# EAGLE design V-00634-00 (EAGLE 7.2.0)
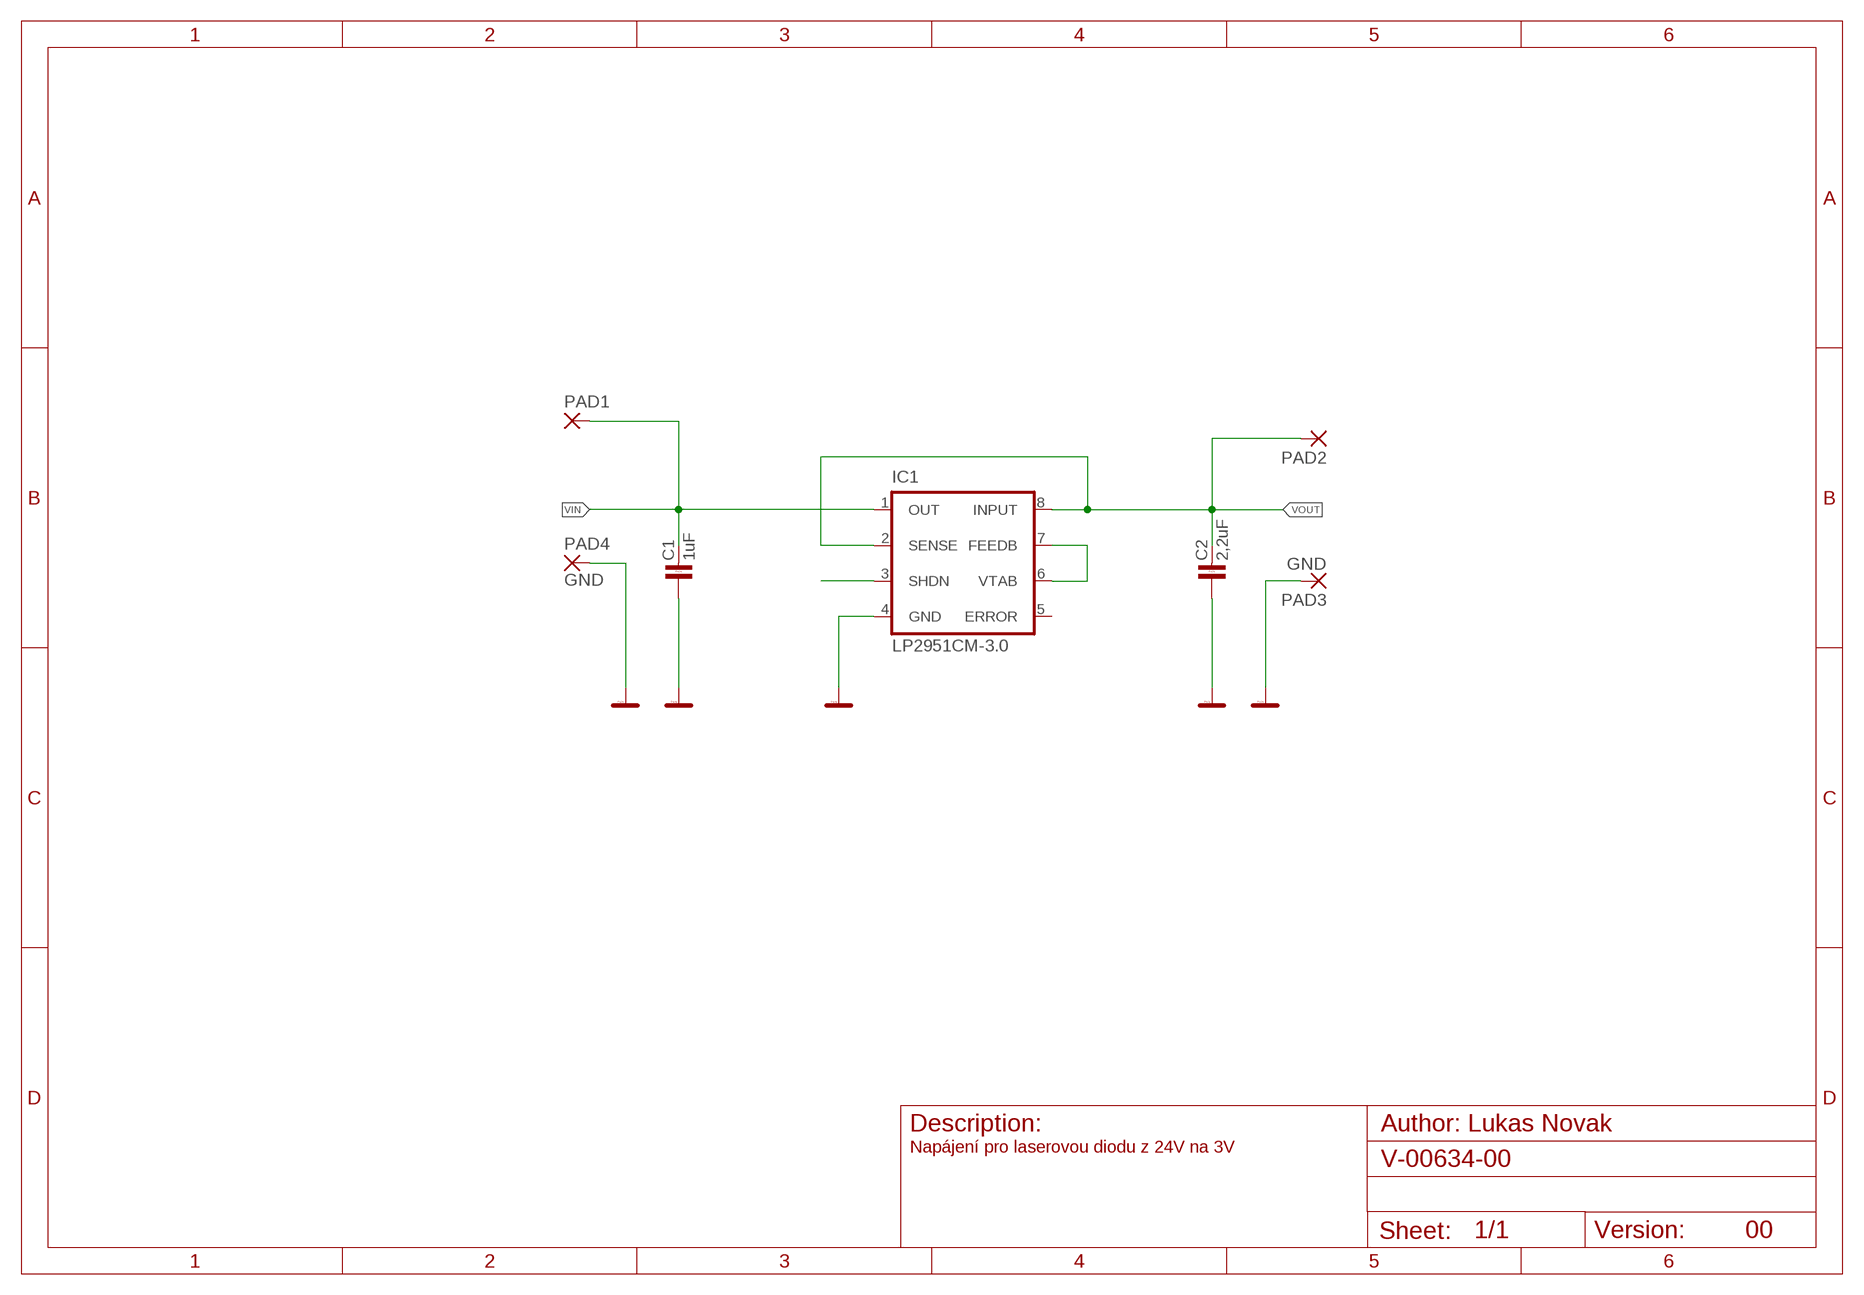
[diagram p0: schematic, sheet 1]

## Parts
C1  1uF  C-KER_1206  [1206]
C2  2,2uF  C-KER_1206  [1206]
IC1  LP2951CM-3.0  [SO-08]
PAD1  2,54/0,9  [2,54/0,9]
PAD2  2,54/0,9  [2,54/0,9]
PAD3  GND  2,54/0,9  [2,54/0,9]
PAD4  GND  2,54/0,9  [2,54/0,9]

## Nets
GND: C1.1 C2.1 IC1.4(GND) PAD3.1(P) PAD4.1(P)
N$1: IC1.6(VTAB) IC1.7(FEEDB)
N$2: IC1.3(SHDN)
VIN: C1.2 IC1.1(OUT) PAD1.1(P)
VOUT: C2.2 IC1.2(SENSE) IC1.8(INPUT) PAD2.1(P)
Unconnected: IC1.5(ERROR)

## Notes on the sheet
- Napájení pro laserovou diodu z 24V na 3V
- 00

## Library data of the parts
C1 C2 = #PaJa_31:C-KER: Kondenzator - keramicky
IC1 = v-reg:LP2951?*: Series of Adjustable Micropower Voltage Regulators Source: http://cache.national.com/ds/LP/LP2950.pdf
PAD1-PAD4 = wirepad:2,54/0,9: THROUGH-HOLE PAD

## Board
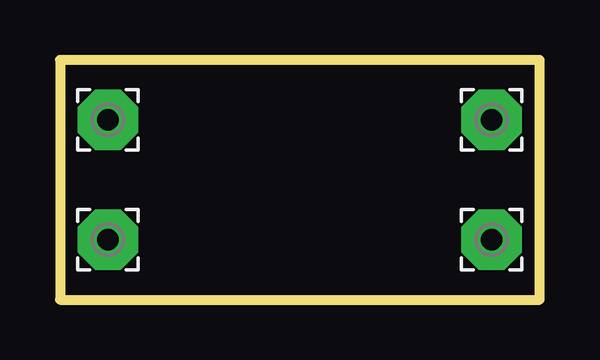
[diagram p1: board, top side]
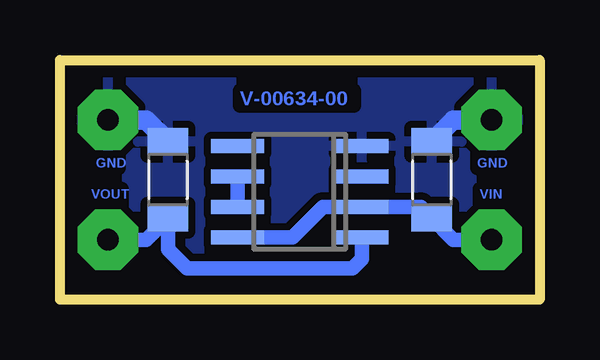
[diagram p2: board, bottom side, seen from below]

Size 20 x 10 mm. Coordinates in mm from the lower left corner, seen from the top.
Outline: 0,0 20,0 20,10 0,10 0,0
Copper layers (1*16): Top 0.04mm / dielectric 1.5mm / Bottom 0.04mm
Design rules "mucha_navrh": minimum track width 0.2mm, minimum drill 0.6mm, track to track 0.3mm, track to pad 0.3mm, pad to pad 0.3mm, via to via 0.3mm, smd to smd 0mil, copper to edge 0.5mm, drill to drill 0.5mm, minimum pad ring 0.3mm, minimum via ring 0.3mm, stop-mask expansion 0.1mm, vias tented up to drill 0.5mm, thermal gap 0.3mm

### Footprints (pad centres in the part's own frame; a part is rotated, then mirrored left to right if it is on the bottom)
1206 = smd 1.143 x 1.702: 1 -1.587,0; 2 1.587,0
SO-08 = smd 0.6 x 2.2: 1 -1.905,-2.6; 2 -0.635,-2.6; 3 0.635,-2.6; 4 1.905,-2.6; 5 1.905,2.6; 6 0.635,2.6; 7 -0.635,2.6; 8 -1.905,2.6
2,54/0,9 = drill 0.914 pad 2.54 octagon: 1 0,0

### Placement (x,y rotation side)
C1  15.5,5 270 bottom
C2  4.5,5 270 bottom
IC1  10,4.5 90 bottom
PAD1  18,2.5 0 top
PAD2  2,2.5 0 top
PAD3  2,7.5 0 top
PAD4  18,7.5 0 top

### Tracks (layer width: path | path; a pad name or v marks a point on that pad's centre or on a via)
GND
  Bottom 0.813: PAD3.1 3.59,7.5 C2.1 | PAD4.1 16.41,7.5 C1.1
  pour Bottom: 0,0 20,0 20,10 0,10
N$1
  Bottom 0.61: IC1.6 IC1.7
VIN
  Bottom 0.61: IC1.1 7.4,1.7 7.8,1.3 14.7,1.3 15.5,2.1 C1.2 16.41,2.5 PAD1.1
VOUT
  Bottom 0.61: PAD2.1 3.59,2.5 C2.2 4.95,3.87 IC1.2 9.04,3.87 10.3,2.6 IC1.8

### Text on the board
Bottom: GND | GND | VIN | VOUT